# EAGLE schematic paris_wheel (EAGLE 7.3.0)
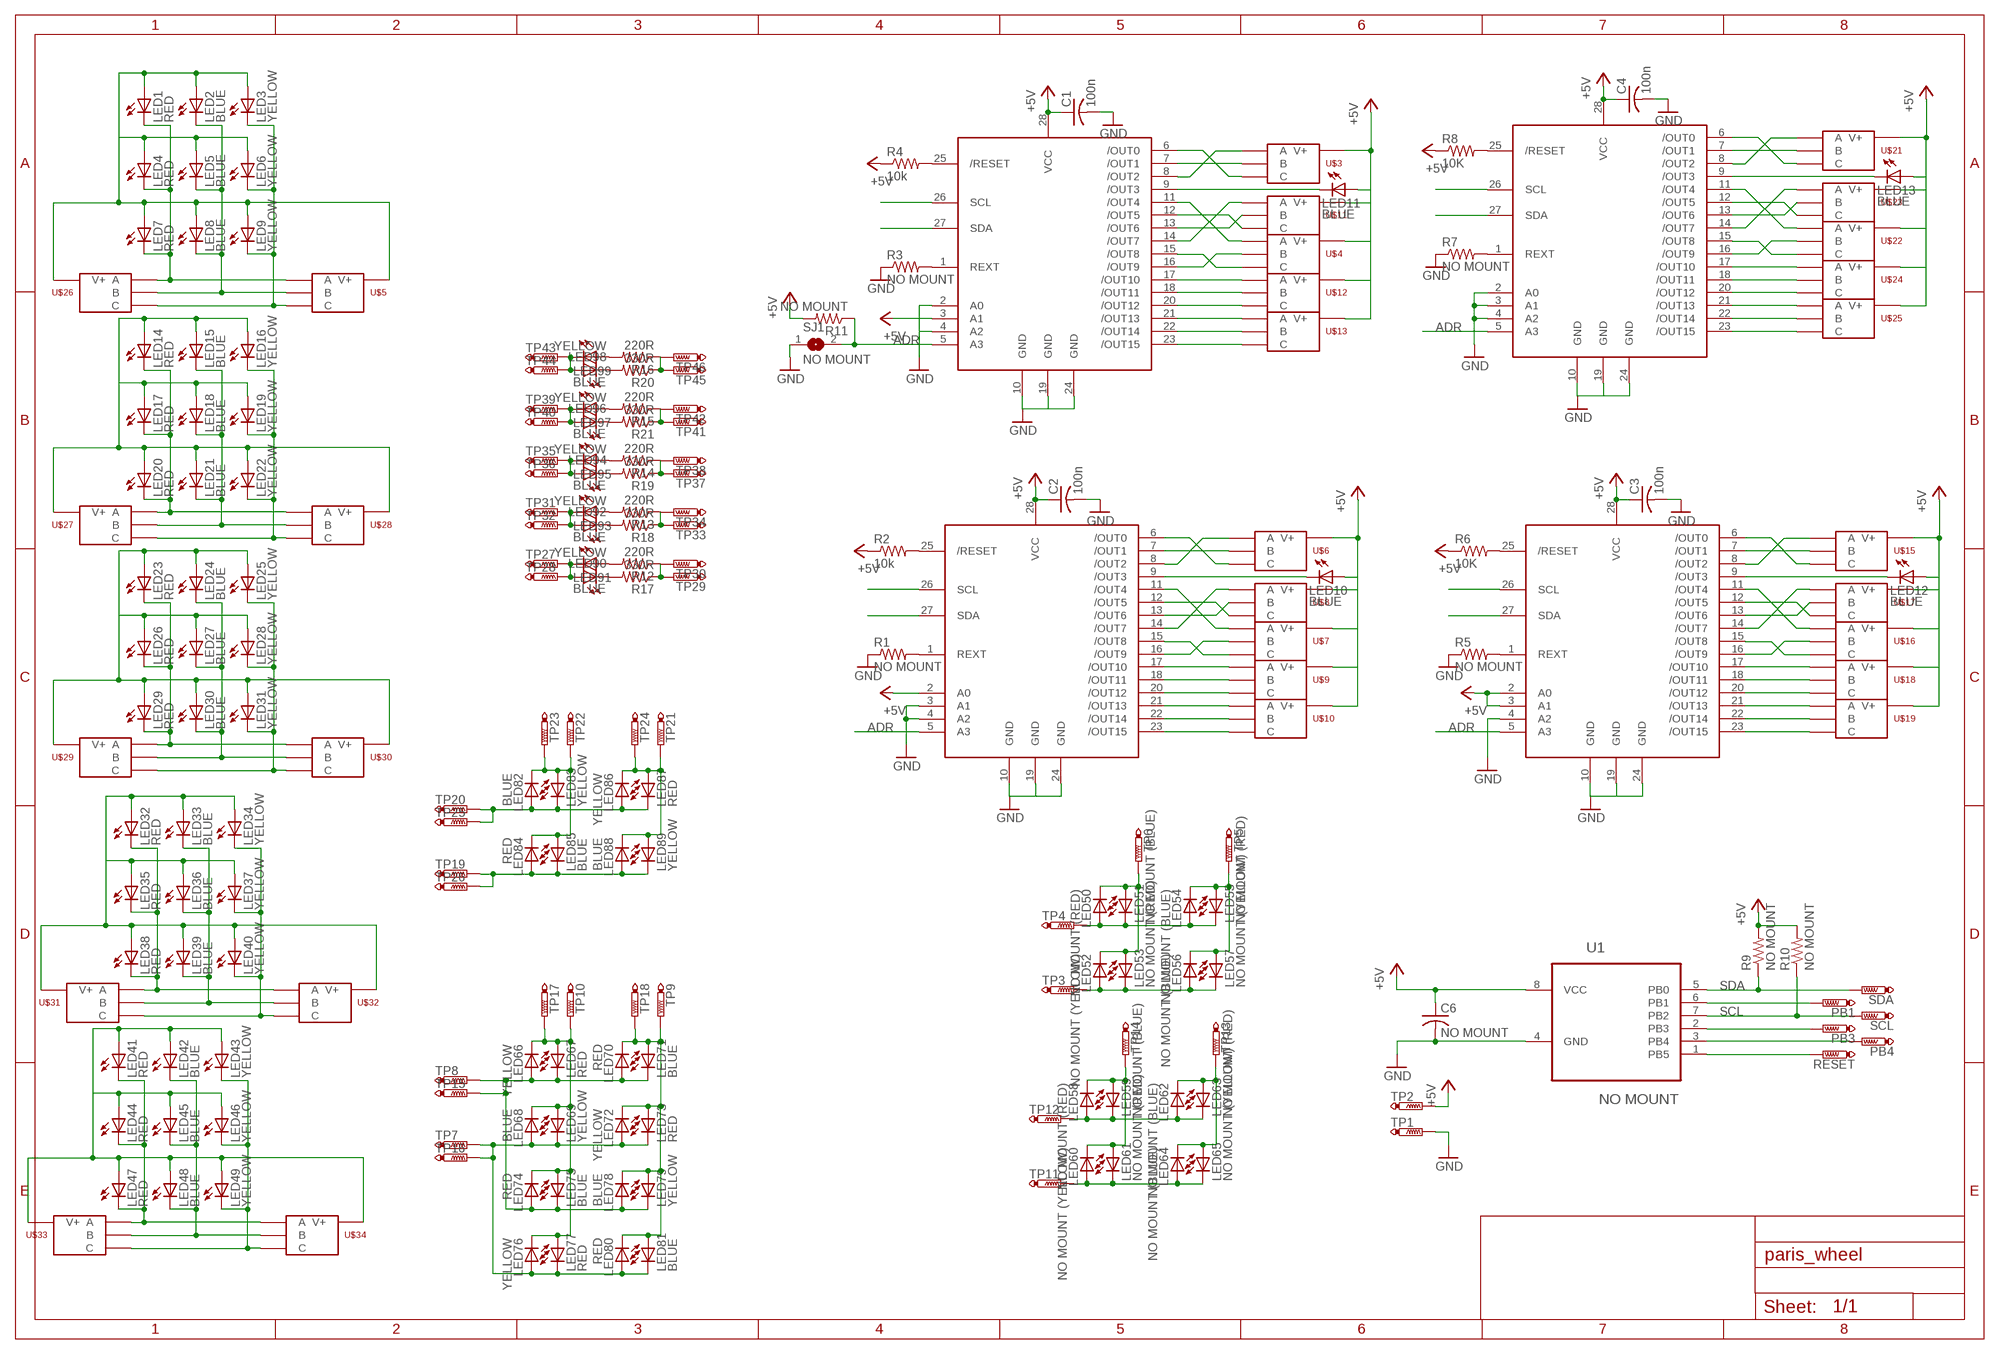
[diagram p0: schematic, sheet 1]

## Parts
C1  100n  C-USC0603  [C0603]
C2  100n  C-USC0603  [C0603]
C3  100n  C-USC0603  [C0603]
C4  100n  C-USC0603  [C0603]
C6  NO MOUNT  C-USC0603  [C0603]
LED1  RED  LEDCHIP-LED0603  [CHIP-LED0603]
LED2  BLUE  LEDCHIP-LED0603  [CHIP-LED0603]
LED3  YELLOW  LEDCHIP-LED0603  [CHIP-LED0603]
LED4  RED  LEDCHIP-LED0603  [CHIP-LED0603]
LED5  BLUE  LEDCHIP-LED0603  [CHIP-LED0603]
LED6  YELLOW  LEDCHIP-LED0603  [CHIP-LED0603]
LED7  RED  LEDCHIP-LED0603  [CHIP-LED0603]
LED8  BLUE  LEDCHIP-LED0603  [CHIP-LED0603]
LED9  YELLOW  LEDCHIP-LED0603  [CHIP-LED0603]
LED10  BLUE  LEDCHIP-LED0603  [CHIP-LED0603]
LED11  BLUE  LEDCHIP-LED0603  [CHIP-LED0603]
LED12  BLUE  LEDCHIP-LED0603  [CHIP-LED0603]
LED13  BLUE  LEDCHIP-LED0603  [CHIP-LED0603]
LED14  RED  LEDCHIP-LED0603  [CHIP-LED0603]
LED15  BLUE  LEDCHIP-LED0603  [CHIP-LED0603]
LED16  YELLOW  LEDCHIP-LED0603  [CHIP-LED0603]
LED17  RED  LEDCHIP-LED0603  [CHIP-LED0603]
LED18  BLUE  LEDCHIP-LED0603  [CHIP-LED0603]
LED19  YELLOW  LEDCHIP-LED0603  [CHIP-LED0603]
LED20  RED  LEDCHIP-LED0603  [CHIP-LED0603]
LED21  BLUE  LEDCHIP-LED0603  [CHIP-LED0603]
LED22  YELLOW  LEDCHIP-LED0603  [CHIP-LED0603]
LED23  RED  LEDCHIP-LED0603  [CHIP-LED0603]
LED24  BLUE  LEDCHIP-LED0603  [CHIP-LED0603]
LED25  YELLOW  LEDCHIP-LED0603  [CHIP-LED0603]
LED26  RED  LEDCHIP-LED0603  [CHIP-LED0603]
LED27  BLUE  LEDCHIP-LED0603  [CHIP-LED0603]
LED28  YELLOW  LEDCHIP-LED0603  [CHIP-LED0603]
LED29  RED  LEDCHIP-LED0603  [CHIP-LED0603]
LED30  BLUE  LEDCHIP-LED0603  [CHIP-LED0603]
LED31  YELLOW  LEDCHIP-LED0603  [CHIP-LED0603]
LED32  RED  LEDCHIP-LED0603  [CHIP-LED0603]
LED33  BLUE  LEDCHIP-LED0603  [CHIP-LED0603]
LED34  YELLOW  LEDCHIP-LED0603  [CHIP-LED0603]
LED35  RED  LEDCHIP-LED0603  [CHIP-LED0603]
LED36  BLUE  LEDCHIP-LED0603  [CHIP-LED0603]
LED37  YELLOW  LEDCHIP-LED0603  [CHIP-LED0603]
LED38  RED  LEDCHIP-LED0603  [CHIP-LED0603]
LED39  BLUE  LEDCHIP-LED0603  [CHIP-LED0603]
LED40  YELLOW  LEDCHIP-LED0603  [CHIP-LED0603]
LED41  RED  LEDCHIP-LED0603  [CHIP-LED0603]
LED42  BLUE  LEDCHIP-LED0603  [CHIP-LED0603]
LED43  YELLOW  LEDCHIP-LED0603  [CHIP-LED0603]
LED44  RED  LEDCHIP-LED0603  [CHIP-LED0603]
LED45  BLUE  LEDCHIP-LED0603  [CHIP-LED0603]
LED46  YELLOW  LEDCHIP-LED0603  [CHIP-LED0603]
LED47  RED  LEDCHIP-LED0603  [CHIP-LED0603]
LED48  BLUE  LEDCHIP-LED0603  [CHIP-LED0603]
LED49  YELLOW  LEDCHIP-LED0603  [CHIP-LED0603]
LED50  NO MOUNT (RED)  LEDCHIP-LED0603  [CHIP-LED0603]
LED51  NO MOUNT (BLUE)  LEDCHIP-LED0603  [CHIP-LED0603]
LED52  NO MOUNT (YELLOW)  LEDCHIP-LED0603  [CHIP-LED0603]
LED53  NO MOUNT (RED)  LEDCHIP-LED0603  [CHIP-LED0603]
LED54  NO MOUNT (BLUE)  LEDCHIP-LED0603  [CHIP-LED0603]
LED55  NO MOUNT (RED)  LEDCHIP-LED0603  [CHIP-LED0603]
LED56  NO MOUNT (BLUE)  LEDCHIP-LED0603  [CHIP-LED0603]
LED57  NO MOUNT (YELLOW)  LEDCHIP-LED0603  [CHIP-LED0603]
LED58  NO MOUNT (RED)  LEDCHIP-LED0603  [CHIP-LED0603]
LED59  NO MOUNT (BLUE)  LEDCHIP-LED0603  [CHIP-LED0603]
LED60  NO MOUNT (YELLOW)  LEDCHIP-LED0603  [CHIP-LED0603]
LED61  NO MOUNT (RED)  LEDCHIP-LED0603  [CHIP-LED0603]
LED62  NO MOUNT (BLUE)  LEDCHIP-LED0603  [CHIP-LED0603]
LED63  NO MOUNT (RED)  LEDCHIP-LED0603  [CHIP-LED0603]
LED64  NO MOUNT (BLUE)  LEDCHIP-LED0603  [CHIP-LED0603]
LED65  NO MOUNT (YELLOW)  LEDCHIP-LED0603  [CHIP-LED0603]
LED66  YELLOW  LEDCHIP-LED0603  [CHIP-LED0603]
LED67  RED  LEDCHIP-LED0603  [CHIP-LED0603]
LED68  BLUE  LEDCHIP-LED0603  [CHIP-LED0603]
LED69  YELLOW  LEDCHIP-LED0603  [CHIP-LED0603]
LED70  RED  LEDCHIP-LED0603  [CHIP-LED0603]
LED71  BLUE  LEDCHIP-LED0603  [CHIP-LED0603]
LED72  YELLOW  LEDCHIP-LED0603  [CHIP-LED0603]
LED73  RED  LEDCHIP-LED0603  [CHIP-LED0603]
LED74  RED  LEDCHIP-LED0603  [CHIP-LED0603]
LED75  BLUE  LEDCHIP-LED0603  [CHIP-LED0603]
LED76  YELLOW  LEDCHIP-LED0603  [CHIP-LED0603]
LED77  RED  LEDCHIP-LED0603  [CHIP-LED0603]
LED78  BLUE  LEDCHIP-LED0603  [CHIP-LED0603]
LED79  YELLOW  LEDCHIP-LED0603  [CHIP-LED0603]
LED80  RED  LEDCHIP-LED0603  [CHIP-LED0603]
LED81  BLUE  LEDCHIP-LED0603  [CHIP-LED0603]
LED82  BLUE  LEDCHIP-LED0603  [CHIP-LED0603]
LED83  YELLOW  LEDCHIP-LED0603  [CHIP-LED0603]
LED84  RED  LEDCHIP-LED0603  [CHIP-LED0603]
LED85  BLUE  LEDCHIP-LED0603  [CHIP-LED0603]
LED86  YELLOW  LEDCHIP-LED0603  [CHIP-LED0603]
LED87  RED  LEDCHIP-LED0603  [CHIP-LED0603]
LED88  BLUE  LEDCHIP-LED0603  [CHIP-LED0603]
LED89  YELLOW  LEDCHIP-LED0603  [CHIP-LED0603]
LED90  YELLOW  LEDCHIP-LED0603  [CHIP-LED0603]
LED91  BLUE  LEDCHIP-LED0603  [CHIP-LED0603]
LED92  YELLOW  LEDCHIP-LED0603  [CHIP-LED0603]
LED93  BLUE  LEDCHIP-LED0603  [CHIP-LED0603]
LED94  YELLOW  LEDCHIP-LED0603  [CHIP-LED0603]
LED95  BLUE  LEDCHIP-LED0603  [CHIP-LED0603]
LED96  YELLOW  LEDCHIP-LED0603  [CHIP-LED0603]
LED97  BLUE  LEDCHIP-LED0603  [CHIP-LED0603]
LED98  YELLOW  LEDCHIP-LED0603  [CHIP-LED0603]
LED99  BLUE  LEDCHIP-LED0603  [CHIP-LED0603]
PB1  TESTPAD  PTR1TP20SQ  [TP20SQ]
PB3  TESTPAD  PTR1TP20SQ  [TP20SQ]
PB4  TESTPAD  PTR1TP20SQ  [TP20SQ]
R1  NO MOUNT  R-US_R0603  [R0603]
R2  10k  R-US_R0603  [R0603]
R3  NO MOUNT  R-US_R0603  [R0603]
R4  10k  R-US_R0603  [R0603]
R5  NO MOUNT  R-US_R0603  [R0603]
R6  10K  R-US_R0603  [R0603]
R7  NO MOUNT  R-US_R0603  [R0603]
R8  10K  R-US_R0603  [R0603]
R9  NO MOUNT  R-US_R0603  [R0603]
R10  NO MOUNT  R-US_R0603  [R0603]
R11  NO MOUNT  R-US_R0603  [R0603]
R12  220R  R-US_R0603  [R0603]
R13  220R  R-US_R0603  [R0603]
R14  220R  R-US_R0603  [R0603]
R15  220R  R-US_R0603  [R0603]
R16  220R  R-US_R0603  [R0603]
R17  330R  R-US_R0603  [R0603]
R18  330R  R-US_R0603  [R0603]
R19  330R  R-US_R0603  [R0603]
R20  330R  R-US_R0603  [R0603]
R21  330R  R-US_R0603  [R0603]
RESET  TESTPAD  PTR1TP20SQ  [TP20SQ]
SCL  TESTPAD  PTR1TP20SQ  [TP20SQ]
SDA  TESTPAD  PTR1TP20SQ  [TP20SQ]
SJ1  NO MOUNT  SJ  [SJ]
TP1  TESTPAD  PTR1TP20SQ  [TP20SQ]
TP2  TESTPAD  PTR1TP20SQ  [TP20SQ]
TP3  TESTPAD  PTR1TP15SQ  [TP15SQ]
TP4  TESTPAD  PTR1TP15SQ  [TP15SQ]
TP5  TESTPAD  PTR1TP15SQ  [TP15SQ]
TP6  TESTPAD  PTR1TP15SQ  [TP15SQ]
TP7  TESTPAD  PTR1TP15SQ  [TP15SQ]
TP8  TESTPAD  PTR1TP15SQ  [TP15SQ]
TP9  TESTPAD  PTR1TP15SQ  [TP15SQ]
TP10  TESTPAD  PTR1TP15SQ  [TP15SQ]
TP11  TESTPAD  PTR1TP15SQ  [TP15SQ]
TP12  TESTPAD  PTR1TP15SQ  [TP15SQ]
TP13  TESTPAD  PTR1TP15SQ  [TP15SQ]
TP14  TESTPAD  PTR1TP15SQ  [TP15SQ]
TP15  TESTPAD  PTR1TP15SQ  [TP15SQ]
TP16  TESTPAD  PTR1TP15SQ  [TP15SQ]
TP17  TESTPAD  PTR1TP15SQ  [TP15SQ]
TP18  TESTPAD  PTR1TP15SQ  [TP15SQ]
TP19  TESTPAD  PTR1TP15SQ  [TP15SQ]
TP20  TESTPAD  PTR1TP15SQ  [TP15SQ]
TP21  TESTPAD  PTR1TP15SQ  [TP15SQ]
TP22  TESTPAD  PTR1TP15SQ  [TP15SQ]
TP23  TESTPAD  PTR1TP15SQ  [TP15SQ]
TP24  TESTPAD  PTR1TP15SQ  [TP15SQ]
TP25  TESTPAD  PTR1TP15SQ  [TP15SQ]
TP26  TESTPAD  PTR1TP15SQ  [TP15SQ]
TP27  TESTPAD  PTR1TP15SQ  [TP15SQ]
TP28  TESTPAD  PTR1TP15SQ  [TP15SQ]
TP29  TESTPAD  PTR1TP15SQ  [TP15SQ]
TP30  TESTPAD  PTR1TP15SQ  [TP15SQ]
TP31  TESTPAD  PTR1TP15SQ  [TP15SQ]
TP32  TESTPAD  PTR1TP15SQ  [TP15SQ]
TP33  TESTPAD  PTR1TP15SQ  [TP15SQ]
TP34  TESTPAD  PTR1TP15SQ  [TP15SQ]
TP35  TESTPAD  PTR1TP15SQ  [TP15SQ]
TP36  TESTPAD  PTR1TP15SQ  [TP15SQ]
TP37  TESTPAD  PTR1TP15SQ  [TP15SQ]
TP38  TESTPAD  PTR1TP15SQ  [TP15SQ]
TP39  TESTPAD  PTR1TP15SQ  [TP15SQ]
TP40  TESTPAD  PTR1TP15SQ  [TP15SQ]
TP41  TESTPAD  PTR1TP15SQ  [TP15SQ]
TP42  TESTPAD  PTR1TP15SQ  [TP15SQ]
TP43  TESTPAD  PTR1TP15SQ  [TP15SQ]
TP44  TESTPAD  PTR1TP15SQ  [TP15SQ]
TP45  TESTPAD  PTR1TP15SQ  [TP15SQ]
TP46  TESTPAD  PTR1TP15SQ  [TP15SQ]
U1  NO MOUNT  ATTINY85-20SU  [SOIC127P798X216-8N]
U$1  TLC59116IPWR  TLC59116  [TSSOP28]
U$2  TLC59116IPWR  TLC59116  [TSSOP28]
U$3  NO MOUNT  MINI-PCB-CONNECTOR-DRIVE-SIDE  [MINI-PCB-CONNECTOR]
U$4  NO MOUNT  MINI-PCB-CONNECTOR-DRIVE-SIDE  [MINI-PCB-CONNECTOR]
U$5  NO MOUNT  MINI-PCB-CONNECTOR-DRIVE-SIDE  [MINI-PCB-CONNECTOR]
U$6  NO MOUNT  MINI-PCB-CONNECTOR-DRIVE-SIDE  [MINI-PCB-CONNECTOR]
U$7  NO MOUNT  MINI-PCB-CONNECTOR-DRIVE-SIDE  [MINI-PCB-CONNECTOR]
U$8  NO MOUNT  MINI-PCB-CONNECTOR-DRIVE-SIDE  [MINI-PCB-CONNECTOR]
U$9  NO MOUNT  MINI-PCB-CONNECTOR-DRIVE-SIDE  [MINI-PCB-CONNECTOR]
U$10  NO MOUNT  MINI-PCB-CONNECTOR-DRIVE-SIDE  [MINI-PCB-CONNECTOR]
U$11  NO MOUNT  MINI-PCB-CONNECTOR-DRIVE-SIDE  [MINI-PCB-CONNECTOR]
U$12  NO MOUNT  MINI-PCB-CONNECTOR-DRIVE-SIDE  [MINI-PCB-CONNECTOR]
U$13  NO MOUNT  MINI-PCB-CONNECTOR-DRIVE-SIDE  [MINI-PCB-CONNECTOR]
U$14  TLC59116IPWR  TLC59116  [TSSOP28]
U$15  NO MOUNT  MINI-PCB-CONNECTOR-DRIVE-SIDE  [MINI-PCB-CONNECTOR]
U$16  NO MOUNT  MINI-PCB-CONNECTOR-DRIVE-SIDE  [MINI-PCB-CONNECTOR]
U$17  NO MOUNT  MINI-PCB-CONNECTOR-DRIVE-SIDE  [MINI-PCB-CONNECTOR]
U$18  NO MOUNT  MINI-PCB-CONNECTOR-DRIVE-SIDE  [MINI-PCB-CONNECTOR]
U$19  NO MOUNT  MINI-PCB-CONNECTOR-DRIVE-SIDE  [MINI-PCB-CONNECTOR]
U$20  TLC59116IPWR  TLC59116  [TSSOP28]
U$21  NO MOUNT  MINI-PCB-CONNECTOR-DRIVE-SIDE  [MINI-PCB-CONNECTOR]
U$22  NO MOUNT  MINI-PCB-CONNECTOR-DRIVE-SIDE  [MINI-PCB-CONNECTOR]
U$23  NO MOUNT  MINI-PCB-CONNECTOR-DRIVE-SIDE  [MINI-PCB-CONNECTOR]
U$24  NO MOUNT  MINI-PCB-CONNECTOR-DRIVE-SIDE  [MINI-PCB-CONNECTOR]
U$25  NO MOUNT  MINI-PCB-CONNECTOR-DRIVE-SIDE  [MINI-PCB-CONNECTOR]
U$26  NO MOUNT  MINI-PCB-CONNECTOR-LED-SIDE  [MINI-PCB-CONNECTOR]
U$27  NO MOUNT  MINI-PCB-CONNECTOR-LED-SIDE  [MINI-PCB-CONNECTOR]
U$28  NO MOUNT  MINI-PCB-CONNECTOR-DRIVE-SIDE  [MINI-PCB-CONNECTOR]
U$29  NO MOUNT  MINI-PCB-CONNECTOR-LED-SIDE  [MINI-PCB-CONNECTOR]
U$30  NO MOUNT  MINI-PCB-CONNECTOR-DRIVE-SIDE  [MINI-PCB-CONNECTOR]
U$31  NO MOUNT  MINI-PCB-CONNECTOR-LED-SIDE  [MINI-PCB-CONNECTOR]
U$32  NO MOUNT  MINI-PCB-CONNECTOR-DRIVE-SIDE  [MINI-PCB-CONNECTOR]
U$33  NO MOUNT  MINI-PCB-CONNECTOR-LED-SIDE  [MINI-PCB-CONNECTOR]
U$34  NO MOUNT  MINI-PCB-CONNECTOR-DRIVE-SIDE  [MINI-PCB-CONNECTOR]

## Nets
+5V: C1.1 C2.1 C3.1 C4.1 C6.1 LED10.A LED11.A LED12.A LED13.A R2.1 R4.1 R6.1 R8.1 R9.2 R10.2 R11.2 TP2.TP U1.8(VCC) U$1.2(A0) U$1.28(VCC) U$2.3(A1) U$2.28(VCC) U$3.A(V+) U$4.A(V+) U$6.A(V+) U$7.A(V+) U$8.A(V+) U$9.A(V+) U$10.A(V+) U$11.A(V+) U$12.A(V+) U$13.A(V+) U$14.2(A0) U$14.3(A1) U$14.28(VCC) U$15.A(V+) U$16.A(V+) U$17.A(V+) U$18.A(V+) U$19.A(V+) U$20.28(VCC) U$21.A(V+) U$22.A(V+) U$23.A(V+) U$24.A(V+) U$25.A(V+)
ADR: R11.1 SJ1.2 U$1.5(A3) U$2.5(A3) U$14.5(A3) U$20.5(A3)
GND: C1.2 C2.2 C3.2 C4.2 C6.2 R1.1 R3.1 R5.1 R7.1 SJ1.1 TP1.TP U1.4(GND) U$1.3(A1) U$1.4(A2) U$1.10(GND) U$1.19(GND) U$1.24(GND) U$2.2(A0) U$2.4(A2) U$2.10(GND) U$2.19(GND) U$2.24(GND) U$14.4(A2) U$14.10(GND) U$14.19(GND) U$14.24(GND) U$20.2(A0) U$20.3(A1) U$20.4(A2) U$20.10(GND) U$20.19(GND) U$20.24(GND)
N$1: R2.2 U$1.25(/RESET)
N$2: LED1.A LED2.A LED3.A LED4.A LED5.A LED6.A LED7.A LED8.A LED9.A U$5.A(V+) U$26.B(V+)
N$3: R3.2 U$2.1(REXT)
N$4: LED1.C LED4.C LED7.C U$5.V+(A) U$26.C(A)
N$5: LED2.C LED5.C LED8.C U$5.C(B) U$26.V+(B)
N$6: LED3.C LED6.C LED9.C U$5.B(C) U$26.A(C)
N$7: U$1.6(/OUT0) U$6.B(C)
N$8: R1.2 U$1.1(REXT)
N$9: U$2.7(/OUT1) U$3.C(B)
N$10: U$1.7(/OUT1) U$6.C(B)
N$11: U$1.8(/OUT2) U$6.V+(A)
N$12: U$1.12(/OUT5) U$8.B(C)
N$13: U$1.13(/OUT6) U$8.C(B)
N$14: U$1.15(/OUT8) U$7.B(C)
N$15: U$1.16(/OUT9) U$7.C(B)
N$16: U$1.14(/OUT7) U$8.V+(A)
N$17: U$1.11(/OUT4) U$7.V+(A)
N$18: U$1.17(/OUT10) U$9.V+(A)
N$19: U$1.18(/OUT11) U$9.C(B)
N$20: U$1.20(/OUT12) U$9.B(C)
N$21: U$1.21(/OUT13) U$10.V+(A)
N$22: U$1.22(/OUT14) U$10.C(B)
N$23: U$1.23(/OUT15) U$10.B(C)
N$24: LED10.C U$1.9(/OUT3)
N$25: U$2.17(/OUT10) U$12.V+(A)
N$26: U$2.18(/OUT11) U$12.C(B)
N$27: U$2.20(/OUT12) U$12.B(C)
N$28: U$2.21(/OUT13) U$13.V+(A)
N$29: U$2.22(/OUT14) U$13.C(B)
N$30: U$2.23(/OUT15) U$13.B(C)
N$31: U$2.13(/OUT6) U$11.C(B)
N$32: U$2.11(/OUT4) U$4.V+(A)
N$33: LED11.C U$2.9(/OUT3)
N$34: U$2.6(/OUT0) U$3.B(C)
N$35: U$2.8(/OUT2) U$3.V+(A)
N$36: U$2.15(/OUT8) U$4.B(C)
N$37: U$2.16(/OUT9) U$4.C(B)
N$38: U$2.12(/OUT5) U$11.B(C)
N$39: U$2.14(/OUT7) U$11.V+(A)
N$40: R4.2 U$2.25(/RESET)
N$41: R5.2 U$14.1(REXT)
N$42: U$14.7(/OUT1) U$15.C(B)
N$43: U$14.17(/OUT10) U$18.V+(A)
N$44: U$14.18(/OUT11) U$18.C(B)
N$45: U$14.20(/OUT12) U$18.B(C)
N$46: U$14.21(/OUT13) U$19.V+(A)
N$47: U$14.22(/OUT14) U$19.C(B)
N$48: U$14.23(/OUT15) U$19.B(C)
N$49: U$14.13(/OUT6) U$17.C(B)
N$50: U$14.11(/OUT4) U$16.V+(A)
N$51: LED12.C U$14.9(/OUT3)
N$52: U$14.6(/OUT0) U$15.B(C)
N$53: U$14.8(/OUT2) U$15.V+(A)
N$54: U$14.15(/OUT8) U$16.B(C)
N$55: U$14.16(/OUT9) U$16.C(B)
N$56: U$14.12(/OUT5) U$17.B(C)
N$57: U$14.14(/OUT7) U$17.V+(A)
N$58: R6.2 U$14.25(/RESET)
N$59: R7.2 U$20.1(REXT)
N$60: U$20.7(/OUT1) U$21.C(B)
N$61: U$20.17(/OUT10) U$24.V+(A)
N$62: U$20.18(/OUT11) U$24.C(B)
N$63: U$20.20(/OUT12) U$24.B(C)
N$64: U$20.21(/OUT13) U$25.V+(A)
N$65: U$20.22(/OUT14) U$25.C(B)
N$66: U$20.23(/OUT15) U$25.B(C)
N$67: U$20.13(/OUT6) U$23.C(B)
N$68: U$20.11(/OUT4) U$22.V+(A)
N$69: LED13.C U$20.9(/OUT3)
N$70: U$20.6(/OUT0) U$21.B(C)
N$71: U$20.8(/OUT2) U$21.V+(A)
N$72: U$20.15(/OUT8) U$22.B(C)
N$73: U$20.16(/OUT9) U$22.C(B)
N$74: U$20.12(/OUT5) U$23.B(C)
N$75: U$20.14(/OUT7) U$23.V+(A)
N$76: R8.2 U$20.25(/RESET)
N$77: RESET.TP U1.1(PB5)
N$78: PB3.TP U1.2(PB3)
N$79: PB4.TP U1.3(PB4)
N$80: PB1.TP U1.6(PB1)
N$81: LED14.A LED15.A LED16.A LED17.A LED18.A LED19.A LED20.A LED21.A LED22.A U$27.B(V+) U$28.A(V+)
N$82: LED14.C LED17.C LED20.C U$27.C(A) U$28.V+(A)
N$83: LED15.C LED18.C LED21.C U$27.V+(B) U$28.C(B)
N$84: LED16.C LED19.C LED22.C U$27.A(C) U$28.B(C)
N$85: LED23.A LED24.A LED25.A LED26.A LED27.A LED28.A LED29.A LED30.A LED31.A U$29.B(V+) U$30.A(V+)
N$86: LED23.C LED26.C LED29.C U$29.C(A) U$30.V+(A)
N$87: LED24.C LED27.C LED30.C U$29.V+(B) U$30.C(B)
N$88: LED25.C LED28.C LED31.C U$29.A(C) U$30.B(C)
N$89: LED32.A LED33.A LED34.A LED35.A LED36.A LED37.A LED38.A LED39.A LED40.A U$31.B(V+) U$32.A(V+)
N$90: LED32.C LED35.C LED38.C U$31.C(A) U$32.V+(A)
N$91: LED33.C LED36.C LED39.C U$31.V+(B) U$32.C(B)
N$92: LED34.C LED37.C LED40.C U$31.A(C) U$32.B(C)
N$93: LED41.A LED42.A LED43.A LED44.A LED45.A LED46.A LED47.A LED48.A LED49.A U$33.B(V+) U$34.A(V+)
N$94: LED41.C LED44.C LED47.C U$33.C(A) U$34.V+(A)
N$95: LED42.C LED45.C LED48.C U$33.V+(B) U$34.C(B)
N$96: LED43.C LED46.C LED49.C U$33.A(C) U$34.B(C)
N$97: LED50.A LED51.C LED54.A LED55.C TP4.TP
N$98: LED54.C LED55.A LED56.C LED57.A TP5.TP
N$99: LED50.C LED51.A LED52.C LED53.A TP6.TP
N$100: LED52.A LED53.C LED56.A LED57.C TP3.TP
N$101: LED58.A LED59.C LED62.A LED63.C TP12.TP
N$102: LED58.C LED59.A LED60.C LED61.A TP14.TP
N$103: LED60.A LED61.C LED64.A LED65.C TP11.TP
N$104: LED62.C LED63.A LED64.C LED65.A TP13.TP
N$105: LED82.A LED83.C LED86.A LED87.C TP20.TP TP25.TP
N$106: LED82.C LED83.A LED84.C LED85.A TP22.TP TP23.TP
N$107: LED84.A LED85.C LED88.A LED89.C TP19.TP TP26.TP
N$108: LED86.C LED87.A LED88.C LED89.A TP21.TP TP24.TP
N$109: LED66.A LED67.C LED70.A LED71.C LED74.A LED75.C LED78.A LED79.C TP8.TP TP15.TP
N$110: LED66.C LED67.A LED68.C LED69.A LED74.C LED75.A LED76.C LED77.A TP10.TP TP17.TP
N$111: LED68.A LED69.C LED72.A LED73.C LED76.A LED77.C LED80.A LED81.C TP7.TP TP16.TP
N$112: LED70.C LED71.A LED72.C LED73.A LED78.C LED79.A LED80.C LED81.A TP9.TP TP18.TP
N$113: R12.1 R17.1 TP29.TP TP30.TP
N$114: LED90.A LED91.C TP27.TP TP28.TP
N$115: LED91.A R12.2
N$116: LED92.A LED93.C TP31.TP TP32.TP
N$117: R13.1 R18.1 TP33.TP TP34.TP
N$118: LED93.A R13.2
N$119: LED94.A LED95.C TP35.TP TP36.TP
N$120: R14.1 R19.1 TP37.TP TP38.TP
N$121: LED95.A R14.2
N$122: LED96.A LED97.C TP39.TP TP40.TP
N$123: R15.1 R21.1 TP41.TP TP42.TP
N$124: LED97.A R15.2
N$125: LED98.A LED99.C TP43.TP TP44.TP
N$126: R16.1 R20.1 TP45.TP TP46.TP
N$127: LED99.A R16.2
N$128: LED90.C R17.2
N$129: LED92.C R18.2
N$130: LED94.C R19.2
N$131: LED98.C R20.2
N$132: LED96.C R21.2
SCL: R10.1 SCL.TP U1.7(PB2) U$1.26(SCL) U$2.26(SCL) U$14.26(SCL) U$20.26(SCL)
SDA: R9.1 SDA.TP U1.5(PB0) U$1.27(SDA) U$2.27(SDA) U$14.27(SDA) U$20.27(SDA)

## Library data of the parts
C1-C4 C6 = rcl:C-US: CAPACITOR, American symbol
LED1-LED99 = led:LED: LED OSRAM: - CHIPLED LG R971, LG N971, LY N971, LG Q971, LY Q971, LO R971, LY R971 LH N974, LH R974 LS Q976, LO Q976, LY Q976 LO Q996 - Hyper CHIPLED LW Q18S LB Q993, LB Q99A, LB R99A - SideLED LS A670, LO A670, LY A670, LG A670, LP A670 LB A673, LV A673, LT A673, LW A673 LH A674 LY A675 LS A676, LA A676, LO A676, LY A676, LW A676 LS A679, LY A679, LG A679 - Hyper Micro SIDELED® LS Y876, LA Y876, LO Y876, LY Y876 LT Y87S - SmartLED LW L88C, LW L88S LB L89C, LB L89S, LG L890 LS L89K, LO L89K, LY L89K LS L896, LA L896, LO L896, LY L896 - TOPLED LS T670, LO T670, LY T670, LG T670, LP T670 LSG T670, LSP T670, LSY T670, LOP T670, LYG T670 LG T671, LOG T671, LSG T671 LB T673, LV T673, LT T673, LW T673 LH T674 LS T676, LA T676, LO T676, LY T676, LB T676, LH T676, LSB T676, LW T676 LB T67C, LV T67C, LT T67C, LS T67K, LO T67K, LY T67K, LW E67C LS E67B, LA E67B, LO E67B, LY E67B, LB E67C, LV E67C, LT E67C LW T67C LS T679, LY T679, LG T679 LS T770, LO T770, LY T770, LG T770, LP T770 LB T773, LV T773, LT T773, LW T773 LH T774 LS E675, LA E675, LY E675, LS T675 LS T776, LA T776, LO T776, LY T776, LB T776 LHGB T686 LT T68C, LB T68C - Hyper Mini TOPLED® LB M676 - Mini TOPLED Santana® LG M470 LS M47K, LO M47K, LY M47K Source: http://www.osram.convergy.de LUXEON: - LUMILED® LXK2-PW12-R00, LXK2-PW12-S00, LXK2-PW14-U00, LXK2-PW14-V00 LXK2-PM12-R00, LXK2-PM12-S00, LXK2-PM14-U00 LXK2-PE12-Q00, LXK2-PE12-R00, LXK2-PE12-S00, LXK2-PE14-T00, LXK2-PE14-U00 LXK2-PB12-K00, LXK2-PB12-L00, LXK2-PB12-M00, LXK2-PB14-N00, LXK2-PB14-P00, LXK2-PB14-Q00 LXK2-PR12-L00, LXK2-PR12-M00, LXK2-PR14-Q00, LXK2-PR14-R00 LXK2-PD12-Q00, LXK2-PD12-R00, LXK2-PD12-S00 LXK2-PH12-R00, LXK2-PH12-S00 LXK2-PL12-P00, LXK2-PL12-Q00, LXK2-PL12-R00 Source: www.luxeon.com KINGBRIGHT: KA-3528ASYC Source: www.kingbright.com
PB1 PB3 PB4 RESET SCL SDA TP1-TP46 = testpad:PTR1: TEST PIN
R1-R21 = rcl:R-US_: RESISTOR, American symbol
SJ1 = jumper:SJ: SMD solder JUMPER
U1 = attiny85:ATTINY85-20SU: 8-bit Microcontroller with In-System Programmable Flash; MPN: ATTINY85-20SU; OC_FARNELL: 1455164; OC_NEWARK: 58M3797; PACKAGE: SOIC-8; SUPPLIER: Atmel
U$1 U$2 U$14 U$20 = tlc:TLC59116
U$3-U$13 U$15-U$19 U$21-U$25 U$28 U$30 U$32 U$34 = mini-connector:MINI-PCB-CONNECTOR-DRIVE-SIDE
U$26 U$27 U$29 U$31 U$33 = mini-connector:MINI-PCB-CONNECTOR-LED-SIDE